# Altium schematic sheet 50_ExpansorIO.SchDoc
size A4; SheetNumber: 12; SheetTotal: 19
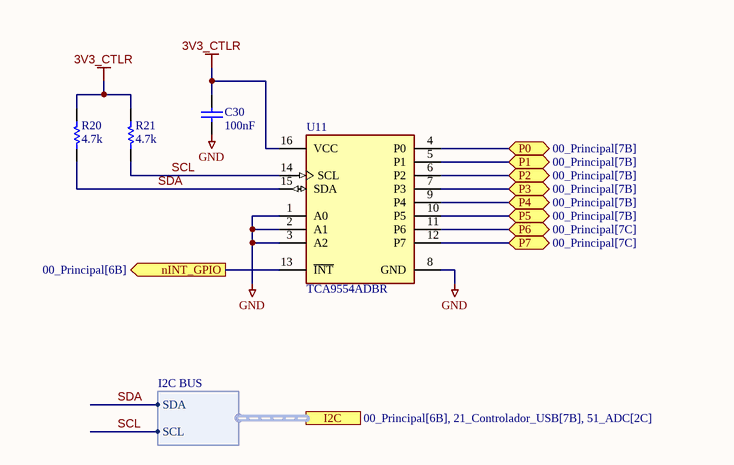
[diagram p0: 50_ExpansorIO.SchDoc]

## Parts
C30  100nF  [CAPC1005X55X25NL05T05]
R20  4.7k  [RESC1005X40X25ML05T10]
R21  4.7k  [RESC1005X40X25ML05T10]
U11  TCA9554ADBR  [FP-DB0016A-MFG]

## Ports
I2C (harness I2C BUS, see 00_Principal[6B], 21_Controlador_USB[7B], 51_ADC[2C]), nINT_GPIO (out, see 00_Principal[6B]), P0 (bidir, see 00_Principal[7B]), P1 (bidir, see 00_Principal[7B]), P2 (bidir, see 00_Principal[7B]), P3 (bidir, see 00_Principal[7B]), P4 (bidir, see 00_Principal[7B]), P5 (bidir, see 00_Principal[7B]), P6 (bidir, see 00_Principal[7C]), P7 (bidir, see 00_Principal[7C])

## Harnesses
I2C BUS: SDA, SCL

## Nets
3V3_CTLR: C30.2 R20.2 R21.2 U11.16(VCC)
GND: C30.1 U11.1(A0) U11.2(A1) U11.3(A2) U11.8(GND)
nINT_GPIO: U11.13(~{INT}) ; port nINT_GPIO
P0: U11.4(P0) ; port P0
P1: U11.5(P1) ; port P1
P2: U11.6(P2) ; port P2
P3: U11.7(P3) ; port P3
P4: U11.9(P4) ; port P4
P5: U11.10(P5) ; port P5
P6: U11.11(P6) ; port P6
P7: U11.12(P7) ; port P7
SCL: R21.1 U11.14(SCL) ; port I2C.SCL
SDA: R20.1 U11.15(SDA) ; port I2C.SDA

## Library data of the parts
C30 = CMP-2008-02030-1: Manufacturer: Vitramon; Part Number: VJ0402Y104KXJCW1BC
R20 R21 = CMP-2002-06456-1: Manufacturer: Panasonic; Part Number: ERJ-S02F4701X
U11 = CMP-04886-000016-1: IC SMBUS I/O EXPANDER I2C 16SSOP; Min Supply Voltage: 1.65V; Max Supply Voltage: 5.5V; Frequency: 400kHz; Number of I/Os: 8; Output Type: PUSH-PULL; Lead Free: Lead Free; RoHS Compliant: Yes; Packaging: Cut Tape; Series: -; Max Operating Temperature: 85°C; Min Operating Temperature: -40°C; Interface: I2C; Mount: Surface Mount; Case/Package: SSOP; Number of Pins: 16; REACH SVHC: No SVHC